# EasyEDA Pro project eLight_core.epro, board PCB_v2
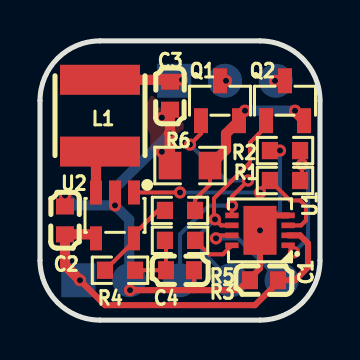
[diagram p11: board, top side]
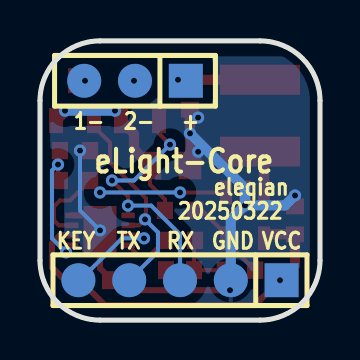
[diagram p12: board, bottom side, seen from below]

Outline 14 x 14 mm; copper layers: Top Layer, Bottom Layer. Coordinates in mm from the lower left corner of the outline.
Outline path: 0,11 0,3 arc(0.88,0.88) 3,0 11,0 arc(13.12,0.88) 14,3 14,11 arc(13.12,13.12) 11,14 3,14 arc(0.88,13.12) 0,11
Stack: Top Layer 0.035mm / Dielectric1 0.71mm FR4 er 4.5 / Bottom Layer 0.035mm

## Design rules (mm)
template: 用户自定义配置
spacing safeClearance (default): track to track 0.152, other pairs 0.152 to 0.3
track width trackWidth (default): min 0.127, default 0.254, max 2.54
differential pair differentialPair (default): width min 0.127, default 0.254, max 2.54; gap min 0.152, default 0.152
via viaSize (default): diameter min 0.5, default 0.61, max 10; hole min 0.3, default 0.305, max 5.999
net GND uses copperRegion1
net $1N3207 uses copperRegion1
net LED+ uses copperRegion1

## Placement (name value [footprint] x y rotation side)
C1  1uF  [C0603]  11.2 2 0 top
C2  10uF  [C0603]  1.25 5 270 top
C3  10uF  [C0603]  6.5 11.25 90 top
C4  1uF  [C0603]  7 2.5 180 top
H1  PZ254V-11-05P  [HDR-TH_5P-P2.54-V-M]  7 2 0 bottom
H2  PZ254V-11-03P  [HDR-TH_3P-P2.54-V-M]  9.25 12 0 bottom
L1  2.2uH  [IND-SMD_L4.0-W4.0_LQH44PN2R2MP0L]  3 10.25 90 top
Q1  AO3400A  [SOT-23-3_L2.9-W1.3-P1.90-LS2.4-BR]  9 11 270 top
Q2  AO3400A  [SOT-23-3_L2.9-W1.3-P1.90-LS2.4-BR]  12.25 11 270 top
R1  100kΩ  [R0603]  12.25 7 180 top
R2  SDNT1608X104F4250FTF  [R0603]  12.25 8.5 0 top
R3  10kΩ  [R0603]  7 4 180 top
R4  220kΩ  [R0603]  4 2.5 180 top
R5  10kΩ  [R0603]  7 5.5 0 top
R6  300mΩ  [R0805]  7.5 7.75 0 top
U1  STC8G1K08A-36I-DFN8  [DFN-8_L3.0-W3.0-P0.50-BL-EP]  11 4.5 90 top
U2  SY8006AAC  [SOT-23-5_L3.0-W1.6-P0.95-LS2.8-BR]  3.75 5.25 90 top

## Footprints (pads in the part's own frame, mm; a bottom-side part is the same pattern mirrored in y, then rotated)
C0603
  rect 0.8x0.9 smd: 1(-0.7,0) 2(0.7,0)
DFN-8_L3.0-W3.0-P0.50-BL-EP
  rect 0.28x0.665 smd: 1(-0.75,-1.407) 2(-0.25,-1.407) 3(0.25,-1.407) 4(0.75,-1.407) 5(0.75,1.407) 6(0.25,1.407) 7(-0.25,1.407) 8(-0.75,1.407)
  rect 2.45x1.65 smd: 9(0,0)
HDR-TH_3P-P2.54-V-M
  rect 1.7x1.7 smd: 1(-2.54,0)
  round 1.7 smd: 2(0,0) 3(2.54,0)
HDR-TH_5P-P2.54-V-M
  rect 1.7x1.7 smd: 1(-5.08,0)
  round 1.7 smd: 2(-2.54,0) 3(0,0) 4(2.54,0) 5(5.08,0)
IND-SMD_L4.0-W4.0_LQH44PN2R2MP0L
  rect 1.5x4 smd: 1(-1.8,0) 2(1.8,0)
R0603
  rect 0.806x0.864 smd: 1(-0.753,0) 2(0.753,0)
R0805
  rect 1.133x1.377 smd: 1(-1,0) 2(1,0)
SOT-23-3_L2.9-W1.3-P1.90-LS2.4-BR
  rect 1.25x0.7 smd: 1(1,-0.95) 2(1,0.95) 3(-1,0)
SOT-23-5_L3.0-W1.6-P0.95-LS2.8-BR
  rect 1.2x0.6 smd: 1(1.15,-0.95) 2(1.15,0) 3(1.15,0.95) 4(-1.15,0.95) 5(-1.15,-0.95)

## Nets
As in the schematic.

## Via types
v1: diameter 0.61, hole 0.305, Top Layer to Bottom Layer, 23 vias

## Routing (per net, layer and track width the routed paths; a pad name or vN(x,y) marks a point on that pad's centre or on a via; arc(x,y) is an arc through that point)
GND: length 32.5
  Top Layer w0.203: C4.1 7.7,1.51 7.69,1.5 ; R2.1 v1(12,8.5)
  Top Layer w0.305: v1(4.5,1.5) 9.9,1.5 11,2.6 v1(11,4.5) 11.75,5.25 U1.4
  Top Layer w0.508: R6.1 v1(6.5,9.36) C3.1 ; C2.1 v1(1.25,6.25) ; U2.2 v1(3.75,5.75)
  Bottom Layer w0.203: v1(11,4.5) 12,5.5 v1(12,8.5)
  Bottom Layer w0.305: v1(4.5,1.5) 4.46,1.54 H1.2
  Bottom Layer w0.508: v1(6.5,9.36) 3.75,6.61 v1(3.75,5.75) ; v1(3.75,5.75) 1.75,5.75 v1(1.25,6.25) ; v1(3.75,5.75) 4.46,5.04 H1.2
  vias: v1(6.09,10.15) v1(6.09,8.44)
VCC: length 19.4
  Top Layer w0.305: U1.2 13,4.25 13.4,3.85 13.4,2.65 12.75,2 12,2 10.75,0.75 3.25,0.75 v1(2,2)
  Top Layer w0.508: U2.4 2.6,4.3 C2.2 1.25,2.75 v1(2,2)
  Bottom Layer w0.508: v1(2,2) H1.1
DIM: length 2.3
  Top Layer w0.203: R3.1 8.45,3.3 9.14,3.3 U1.8
EN1: length 11
  Top Layer w0.203: U1.6 9.05,4.75 8.7,5.1 ; v1(8.75,5.05) 8.7,5.1 ; 8.7,5.1 8.7,6.1 10.5,7.9 10.5,8.9 11.3,9.7 Q2.1
  Bottom Layer w0.203: H1.4 8.1,3.44 8.1,4.4 v1(8.75,5.05)
EN2: length 12.7
  Top Layer w0.203: Q1.1 8.05,9.35 v1(7.5,8.8) ; v1(10.4,7) 9.59,6.19 U1.5
  Bottom Layer w0.203: H1.3 7,4.3 8.44,5.74 v1(9.6,5.74) ; v1(10.4,7) 9.3,7 v1(7.5,8.8)
KEY: length 5
  Top Layer w0.203: v1(8.8,4.1) 8.95,4.25 U1.7
  Bottom Layer w0.203: v1(8.8,4.1) 9.9,4.1 12,2 H1.5
L_EN: length 11.1
  Top Layer w0.203: v1(7,6.4) U2.1 ; v1(11,6.4) 11,6.5 R1.2 11.5,7 12.5,6 13,6 13.3,5.7 13.3,5 13.05,4.75 U1.3
  Bottom Layer w0.203: v1(11,6.4) v1(7,6.4)
LED+: length 4.1
  Top Layer w0.508: L1.2 v1(7.1,12.05)
LED-: length 9.2
  Top Layer w0.203: R6.2 8.5,6.8 7.75,6.05 R5.2
  Top Layer w0.508: Q2.2 12.75,10.45 v1(12.75,10.5) ; v1(10.25,10.5) 9.95,10.2 Q1.2 9.3,9.35 9.3,8.55 R6.2
  Bottom Layer w0.508: v1(12.75,10.5) v1(10.25,10.5)
NTC: length 6.9
  Top Layer w0.203: R2.2 13.1,8.4 v1(13.1,7.8) 13.1,7.1 R1.1 ; v1(12.7,3.4) 12.7,3.46 U1.1
  Bottom Layer w0.203: v1(13.1,7.8) 13.4,7.5 13.4,4.1 v1(12.7,3.4)
$1N3190: length 2.1
  Top Layer w0.508: L1.1 2.8,8.25 U2.3
$1N3207:
  vias: v1(9.3,12)
$1N7267: length 0.5
  Top Layer w0.508: Q2.3 v1(11.75,12)
  Bottom Layer w0.508: v1(11.75,12) H2.3
$1N42712: length 4.4
  Top Layer w0.203: R4.2 4.7,3.95 U2.5 4.7,4.3 5.9,5.5 R5.1
$1N42727: length 3.1
  Top Layer w0.203: R4.1 C4.2 6.3,3.95 R3.2

## Copper pours and planes (outline as drawn; the poured copper is in the pictures)
GND on Top Layer: 5.35,11.33 7.5,11.33 7.5,7 5.35,7
GND on Bottom Layer: 0,13.22 14,13.22 14,0.61 0,0.61

## Text on the board
Bottom Silkscreen Layer: VCC | eleqian | GND | + | 20250322 | RX | 2- | TX | 1- | KEY | eLight-Core
